# EAGLE design Lab Controller Board v03 (EAGLE 7.5.0)
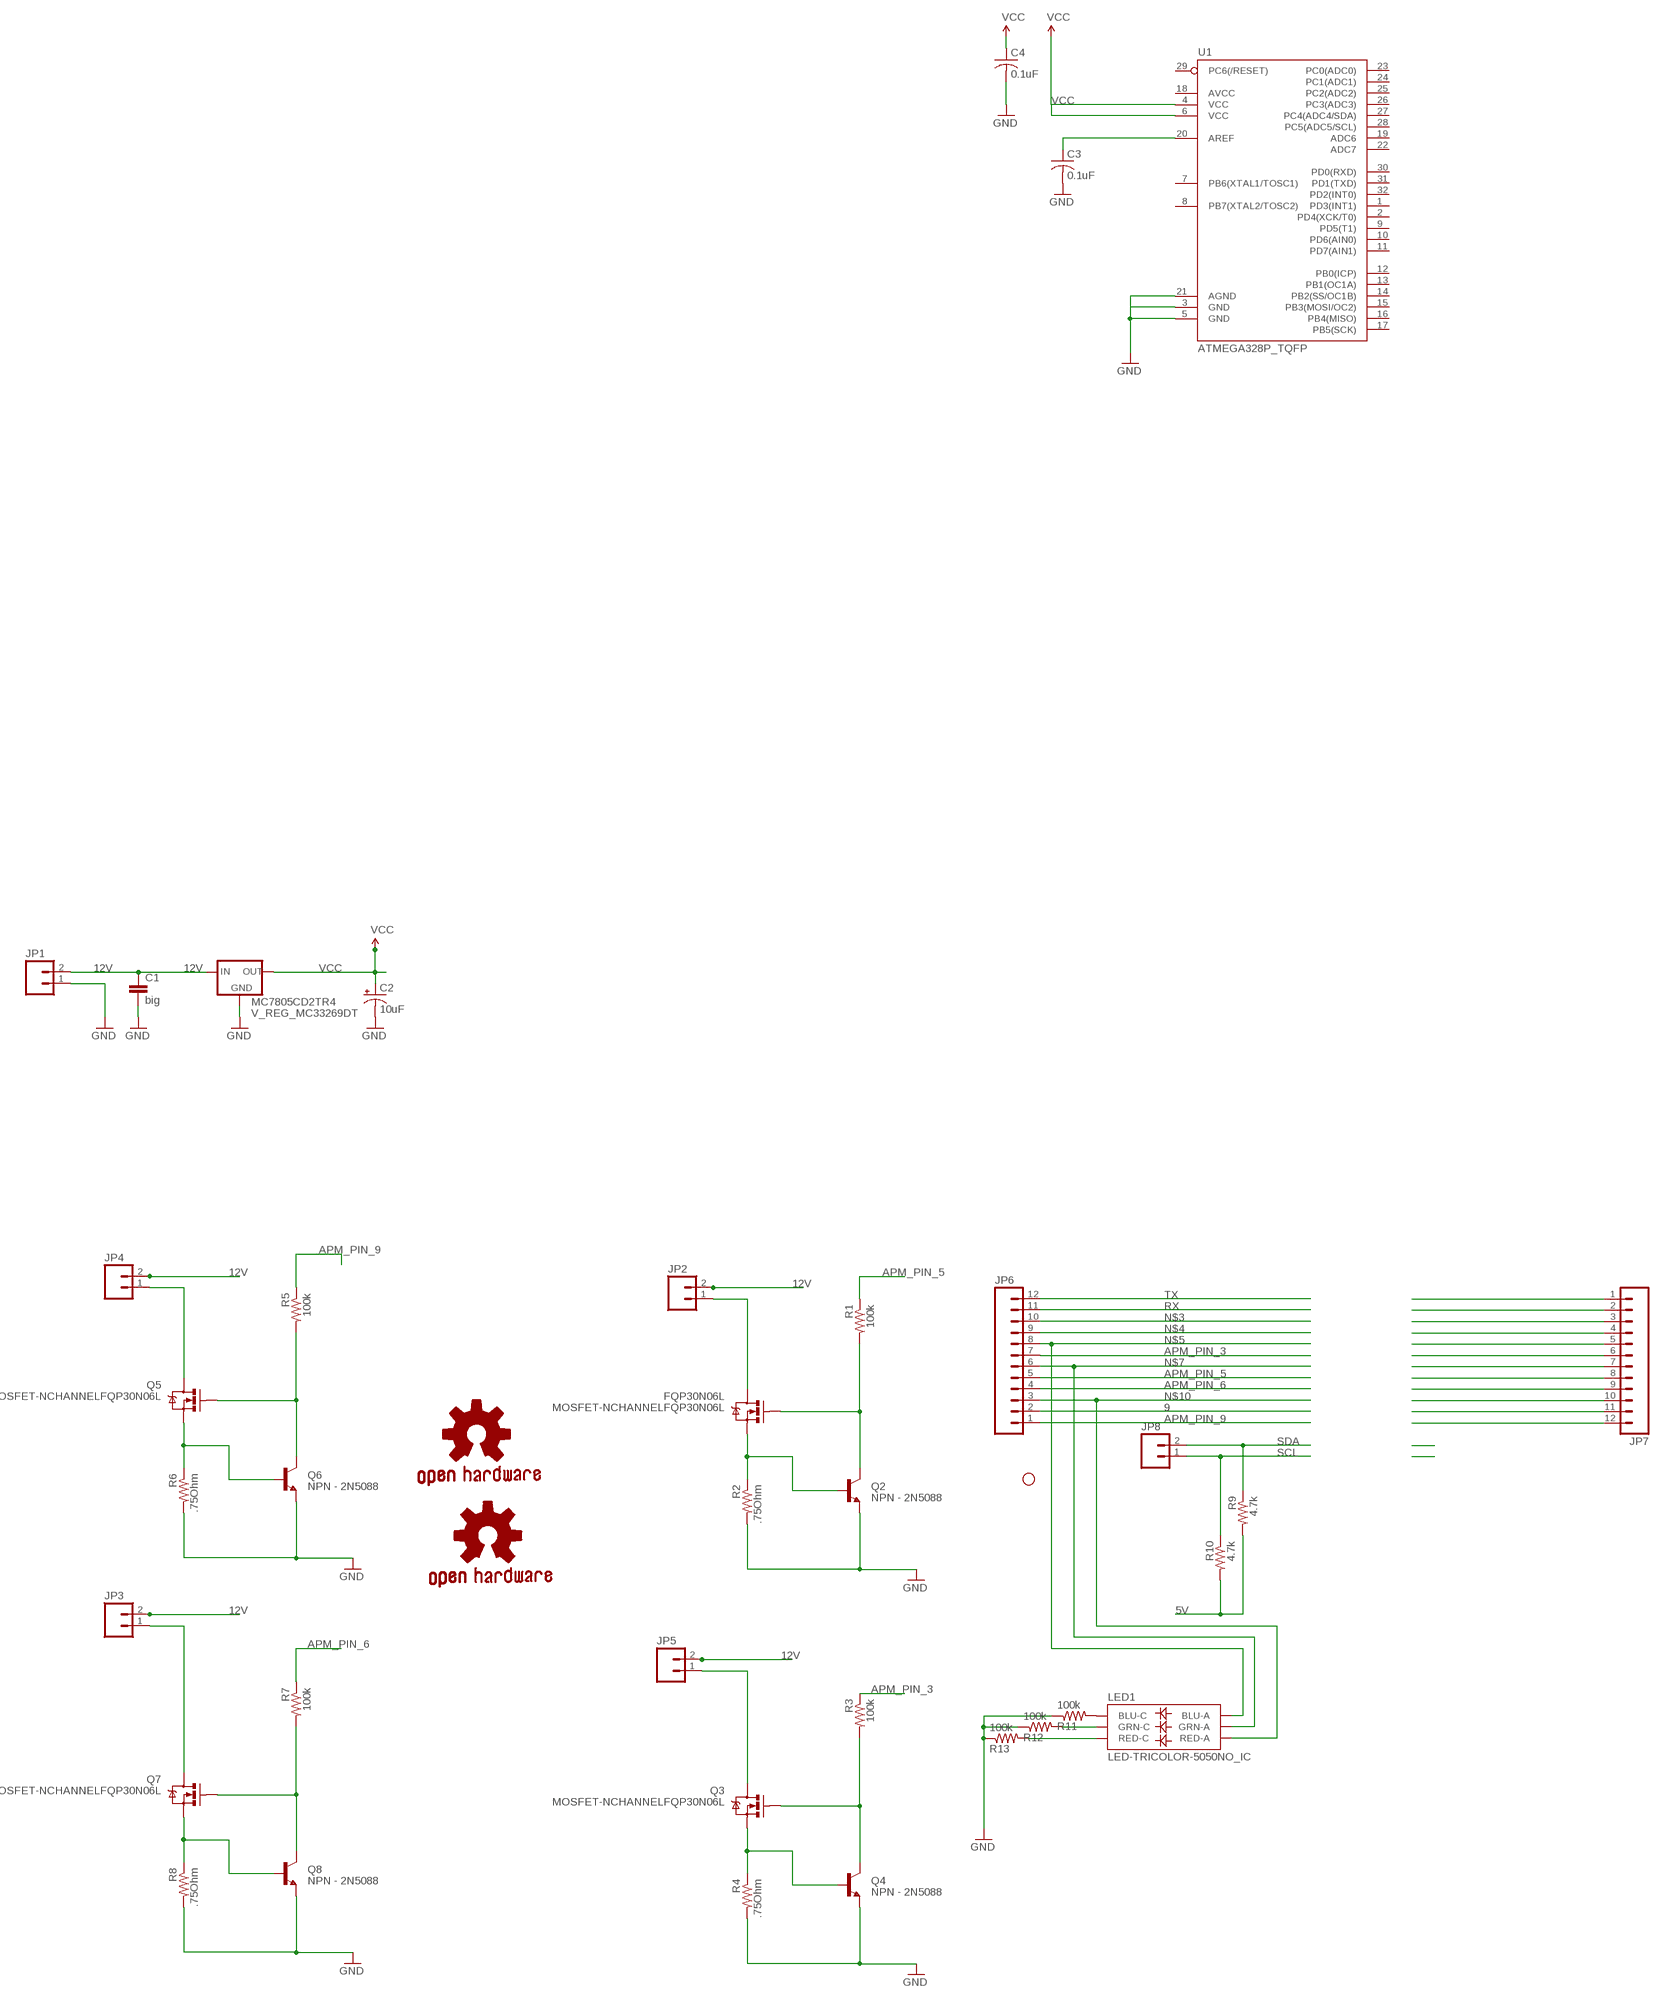
[diagram p0: schematic, sheet 1]

## Parts
C1  big  CAPPTH1  [CAP-PTH-5MM]
C2  10uF  CAP_POL3528  [EIA3528]
C3  0.1uF  C-USC0402  [C0402]
C4  0.1uF  C-USC0402  [C0402]
FQP30N06L  MOSFET-NCHANNELFQP30N06L  [TO220V]
GOLD_ORB_SM1  OSHWLOGO_GOLD_ORB_MED  [OSHW1]
GOLD_ORB_SM2  OSHWLOGO_GOLD_ORB_SM  [OSHW2]
JP1  M025MM  [SCREWTERMINAL-5MM-2]
JP2  M025MM  [SCREWTERMINAL-5MM-2]
JP3  M025MM  [SCREWTERMINAL-5MM-2]
JP4  M025MM  [SCREWTERMINAL-5MM-2]
JP5  M025MM  [SCREWTERMINAL-5MM-2]
JP6  M12PTH  [1X12]
JP7  M12PTH  [1X12]
JP8  M02LOCK  [1X02_LOCK]
LED1  LED-TRICOLOR-5050NO_IC  [LED-TRICOLOR-5050]
MC7805CD2TR4  V_REG_MC33269DT  [DPAK]
Q2  NPN - 2N5088  TRANSISTOR_NPNTO92  [TO-92]
Q3  MOSFET-NCHANNELFQP30N06L  [TO220V]
Q4  NPN - 2N5088  TRANSISTOR_NPNTO92  [TO-92]
Q5  MOSFET-NCHANNELFQP30N06L  [TO220V]
Q6  NPN - 2N5088  TRANSISTOR_NPNTO92  [TO-92]
Q7  MOSFET-NCHANNELFQP30N06L  [TO220V]
Q8  NPN - 2N5088  TRANSISTOR_NPNTO92  [TO-92]
R1  100k  R-US_R0805W  [R0805W]
R2  .75Ohm  R-US_0411/3V  [0411V]
R3  100k  R-US_R0805W  [R0805W]
R4  .75Ohm  R-US_0411/3V  [0411V]
R5  100k  R-US_R0805W  [R0805W]
R6  .75Ohm  R-US_0411/3V  [0411V]
R7  100k  R-US_R0805W  [R0805W]
R8  .75Ohm  R-US_0411/3V  [0411V]
R9  4.7k  R-US_M0805  [M0805]
R10  4.7k  R-US_M0805  [M0805]
R11  100k  R-US_R0805W  [R0805W]
R12  100k  R-US_R0805W  [R0805W]
R13  100k  R-US_R0805W  [R0805W]
STANDOFF1  STAND-OFF  [STAND-OFF]
U1  ATMEGA328P_TQFP  [TQFP32-08]

## Nets
5V: R9.2 R10.2
9: JP6.2
12V: C1.1 JP1.2 JP2.2 JP3.2 JP4.2 JP5.2 MC7805CD2TR4.3(IN)
APM_PIN_3: JP6.7 R3.1
APM_PIN_5: JP6.5 R1.1
APM_PIN_6: JP6.4 R7.1
APM_PIN_9: JP6.1 R5.1
FET_SOURCE: FQP30N06L.3(S) Q2.2(B) R2.1
FET_SOURCE1: Q3.3(S) Q4.2(B) R4.1
FET_SOURCE2: Q5.3(S) Q6.2(B) R6.1
FET_SOURCE3: Q7.3(S) Q8.2(B) R8.1
GND: C1.2 C2.C(-) C3.2 C4.2 JP1.1 MC7805CD2TR4.1(GND) Q2.1(E) Q4.1(E) Q6.1(E) Q8.1(E) R2.2 R4.2 R6.2 R8.2 R11.1 R12.1 R13.1 U1.3(GND) U1.5(GND) U1.21(AGND)
LED_DRAIN: FQP30N06L.2(D) JP2.1
LED_DRAIN1: JP5.1 Q3.2(D)
LED_DRAIN2: JP4.1 Q5.2(D)
LED_DRAIN3: JP3.1 Q7.2(D)
N$1: C3.1 U1.20(AREF)
N$3: JP6.10
N$4: JP6.9
N$5: JP6.8 LED1.3(BLU-A)
N$6: LED1.4(BLU-C) R11.2
N$7: JP6.6 LED1.1(GRN-A)
N$8: LED1.6(GRN-C) R12.2
N$9: LED1.5(RED-C) R13.2
N$10: JP6.3 LED1.2(RED-A)
N$15: JP7.1
N$16: JP7.2
N$17: JP7.3
N$18: JP7.4
N$19: JP7.5
N$20: JP7.6
N$21: JP7.7
N$22: JP7.8
N$23: JP7.9
N$24: JP7.10
N$25: JP7.11
N$26: JP7.12
PWM_B: FQP30N06L.1(G) Q2.3(C) R1.2
PWM_B1: Q3.1(G) Q4.3(C) R3.2
PWM_B2: Q5.1(G) Q6.3(C) R5.2
PWM_B3: Q7.1(G) Q8.3(C) R7.2
RX: JP6.11
SCL: JP8.1 R10.1
SDA: JP8.2 R9.1
TX: JP6.12
VCC: C2.A(+) C4.1 MC7805CD2TR4.4(OUT) U1.4(VCC) U1.6(VCC)
Unconnected: U1.1(PD3(INT1)) U1.2(PD4(XCK/T0)) U1.7(PB6(XTAL1/TOSC1)) U1.8(PB7(XTAL2/TOSC2)) U1.9(PD5(T1)) U1.10(PD6(AIN0)) U1.11(PD7(AIN1)) U1.12(PB0(ICP)) U1.13(PB1(OC1A)) U1.14(PB2(SS/OC1B)) U1.15(PB3(MOSI/OC2)) U1.16(PB4(MISO)) U1.17(PB5(SCK)) U1.18(AVCC) U1.19(ADC6) U1.22(ADC7) U1.23(PC0(ADC0)) U1.24(PC1(ADC1)) U1.25(PC2(ADC2)) U1.26(PC3(ADC3)) U1.27(PC4(ADC4/SDA)) U1.28(PC5(ADC5/SCL)) U1.29(PC6(/RESET)) U1.30(PD0(RXD)) U1.31(PD1(TXD)) U1.32(PD2(INT0))

## Library data of the parts
C1 = SparkFun-Passives:CAP: Capacitor Standard 0603 ceramic capacitor, and 0.1" leaded capacitor.
C2 = SparkFun-Capacitors:CAP_POL: Capacitor Polarized These are standard SMD and PTH capacitors. Normally 10uF, 47uF, and 100uF in electrolytic and tantalum varieties. Always verify the external diameter of the through hole cap, it varies with capacity, voltage, and manufacturer. The EIA devices should be standard.
C3 C4 = resistor:C-US: CAPACITOR, American symbol
FQP30N06L Q3 Q5 Q7 = SparkFun-DiscreteSemi:MOSFET-NCHANNEL: Common NMOSFET Parts MFG P/N Store ID Prod ID FDD8780 TRANS-09984 SI7820DN TRANS-11055 FDS6630A IC-08089 2N7002PW TRANS-11151 FQP30N06L COM-10213 TRANS-10060 BSS123LT1G TRANS-08345 BSS138 TRANS-00830 BS170 2N7000; PROD_ID: TRANS-10060
GOLD_ORB_SM1 GOLD_ORB_SM2 = bfl:OSHWLOGO: These are Open-Source Hardware logos.
JP1-JP5 = SparkFun-Connectors:M02: Standard 2-pin 0.1" header. Use with - straight break away headers ( PRT-00116) - right angle break away headers (PRT-00553) - swiss pins (PRT-00743) - machine pins (PRT-00117) - female headers (PRT-00115) Molex polarized connector foot print use with: PRT-08233 with associated crimp pins and housings. 2.54_SCREWTERM for use with PRT-10571. 3.5mm Screw Terminal footprints for PRT-08084 5mm Screw Terminal footprints for use with PRT-08432; STOREFRONT_ID: PRT-08432
JP6 JP7 = SparkFun-Connectors:M12: Header 12 Standard 12-pin 0.1" header. Use with straight break away headers (SKU : PRT-00116), right angle break away headers (PRT-00553), swiss pins (PRT-00743), machine pins (PRT-00117), and female headers (PRT-00115).
JP8 = SparkFun-Connectors:M02: Standard 2-pin 0.1" header. Use with - straight break away headers ( PRT-00116) - right angle break away headers (PRT-00553) - swiss pins (PRT-00743) - machine pins (PRT-00117) - female headers (PRT-00115) Molex polarized connector foot print use with: PRT-08233 with associated crimp pins and housings. 2.54_SCREWTERM for use with PRT-10571. 3.5mm Screw Terminal footprints for PRT-08084 5mm Screw Terminal footprints for use with PRT-08432
LED1 = SparkFun-LED:LED-TRICOLOR-5050
MC7805CD2TR4 = SparkFun-PowerIC:V_REG_MC33269
Q2 Q4 Q6 Q8 = SparkFun-DiscreteSemi:TRANSISTOR_NPN: Generic NPN BJT MMBT2222A - TRANS-08049 (SOT-23, 1A 40V) MPSA42 - TRANS-09116 (SOT-23, 500mA 300V) MMBT5088LT1G - TRANS-11160 (SOT-23, 50 mA 30V) BC547 - COM-08928 <http://www.sparkfun.com/products/8928> (TO-92 45V 100mA) (1.Collector 2.Base 3.Emitter) 2N3904 - COM-00521 <http://www.sparkfun.com/products/521> (TO-92 40V 200mA) (1.Emitter 2.Base 3.Collector) P2N2222A - COM-12852 <http://www.sparkfun.com/products/12852> (TO-92 40V 600mA) (1.Collector 2.Base 3.Emitter)
R1-R13 = resistor:R-US_: RESISTOR, American symbol
STANDOFF1 = SparkFun-Electromechanical:STAND-OFF: #4 Stand Off This is the mechanical footprint for a #4 phillips button head screw. Use the keepout ring to avoid running the screw head into surrounding components. SKU : PRT-00447
U1 = SparkFun-DigitalIC:ATMEGA328P_TQFP; PROD_ID: IC-09069

## Board
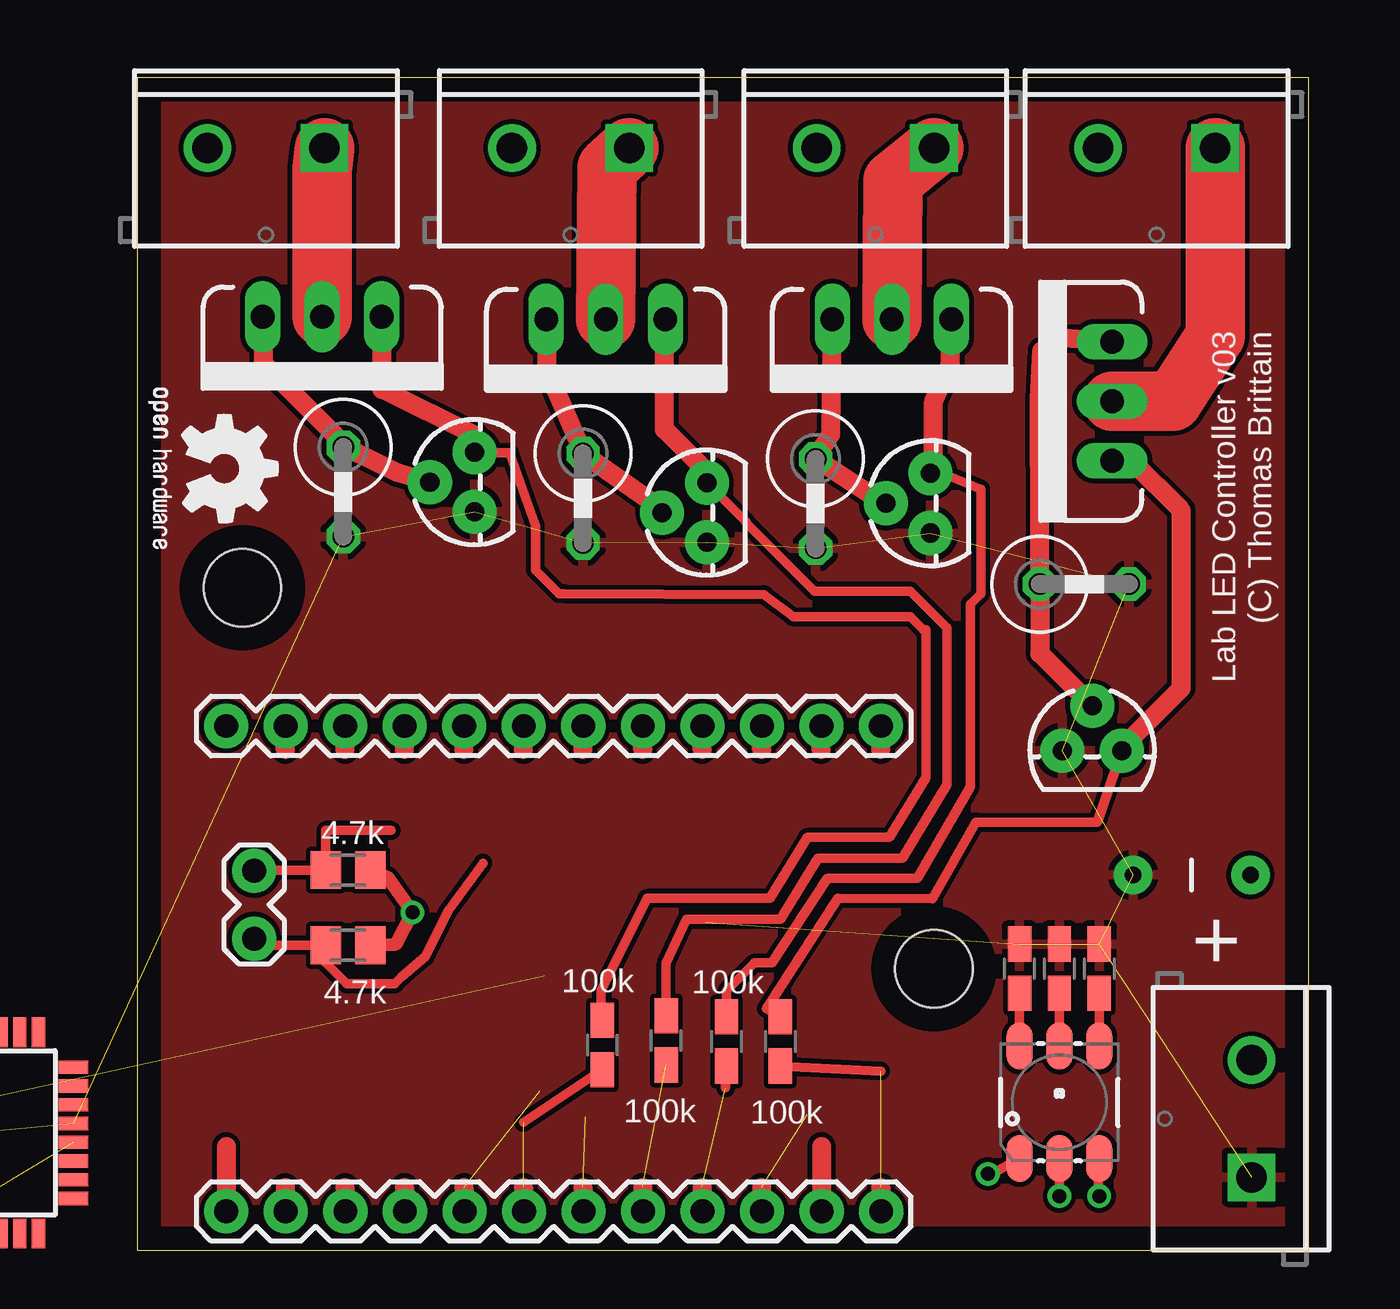
[diagram p1: board, top side]
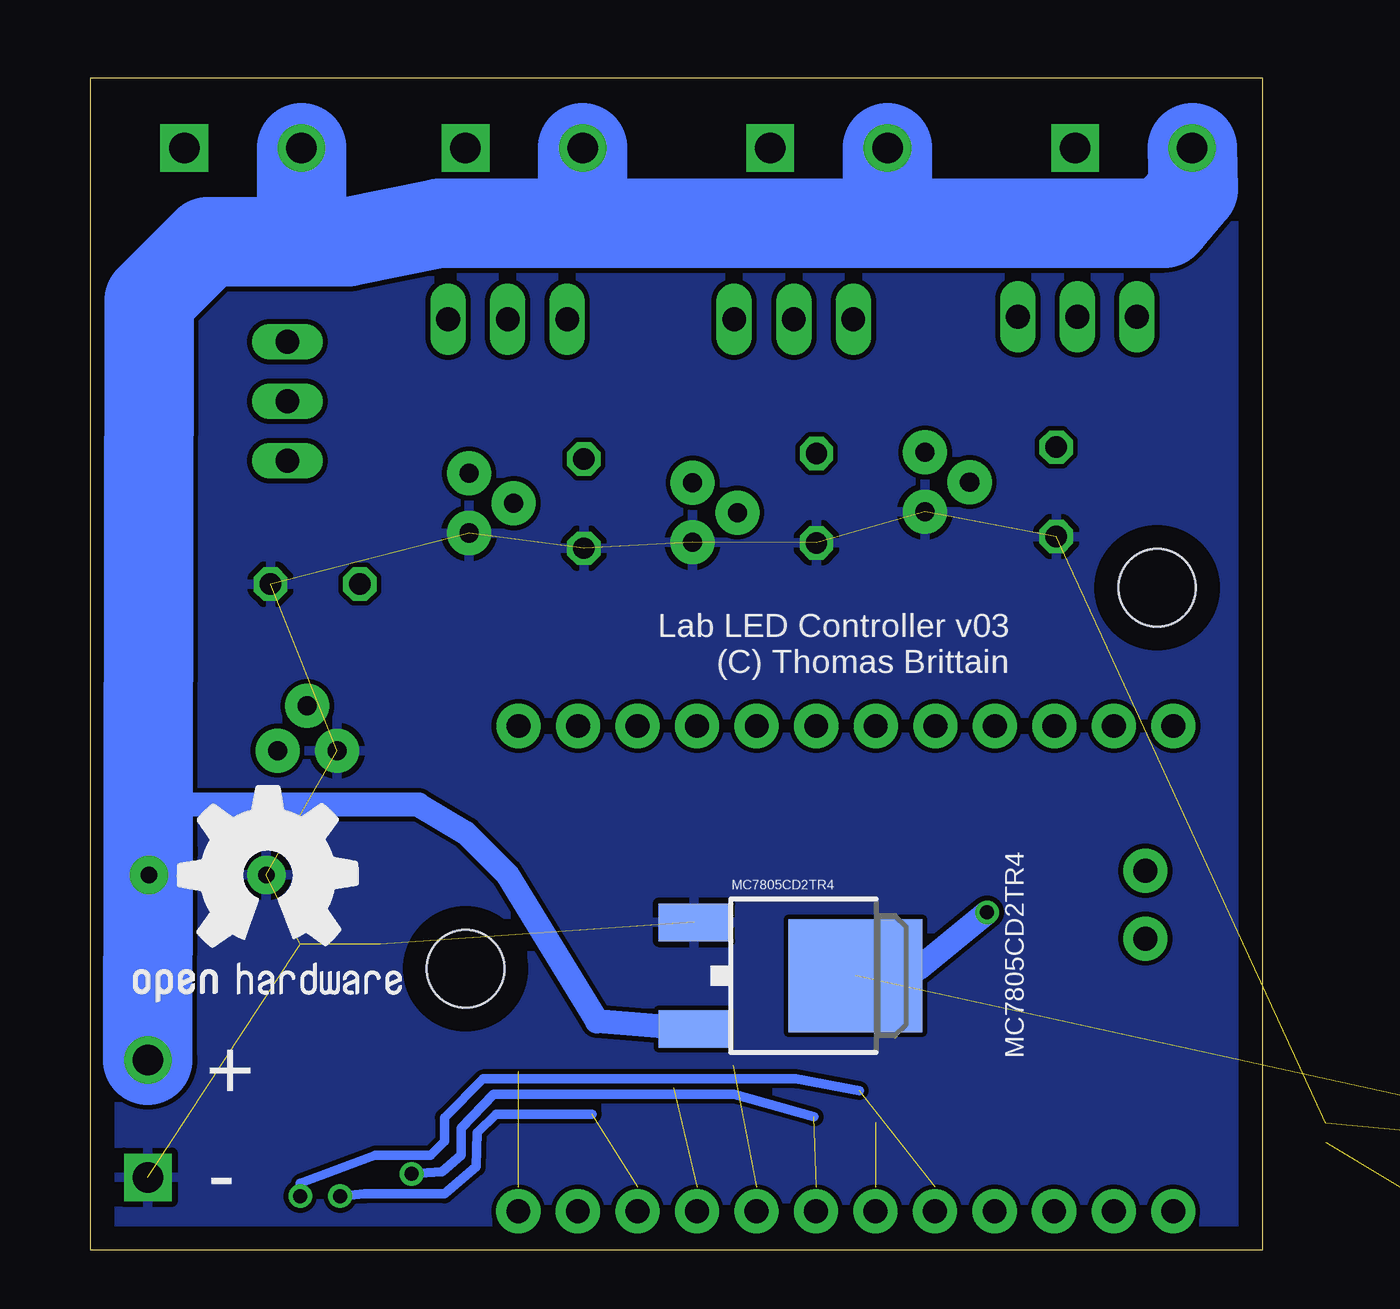
[diagram p2: board, bottom side, seen from below]

Size 50 x 50 mm. Coordinates in mm from the lower left corner, seen from the top.
Outline: 0,0 50,0 50,50 0,50 0,0
Copper layers (1*16): Top 0.035mm / dielectric 1.5mm / Bottom 0.035mm
Design rules "default *": minimum track width 10mil, minimum drill 24mil, track to track 8mil, track to pad 8mil, pad to pad 8mil, via to via 8mil, smd to smd 8mil, copper to edge 40mil, drill to drill 8mil, minimum pad ring 10mil, minimum via ring 8mil, stop-mask expansion 4mil, vias tented up to drill 1.0064mm, thermal gap 10mil

### Footprints (pad centres in the part's own frame; a part is rotated, then mirrored left to right if it is on the bottom)
CAP-PTH-5MM = drill 0.7 pad 1.651: 1 -2.5,0; 2 2.5,0
EIA3528 = smd 1.2 x 2.5: A 1.65,0; C -1.65,0
C0402 = smd 0.7 x 0.9: 1 -0.65,0; 2 0.65,0
TO220V = drill 1.016 long: 1 -2.54,0; 2 0,0; 3 2.54,0
SCREWTERMINAL-5MM-2 = drill 1.3 pad 2.032 square: 1 0,0 | drill 1.3 pad 2.032: 2 5,0
1X12 = drill 1.016 pad 1.88: 1 0,0; 2 2.54,0; 3 5.08,0; 4 7.62,0; 5 10.16,0; 6 12.7,0; 7 15.24,0; 8 17.78,0; 9 20.32,0; 10 22.86,0; 11 25.4,0; 12 27.94,0
1X02_LOCK = drill 1.016 pad 1.88: 1 -0.178,0; 2 2.718,0
LED-TRICOLOR-5050 = smd 2 x 1.1: 1 -2.4,1.7; 2 -2.4,0; 3 -2.4,-1.7; 4 2.4,-1.7; 5 2.4,0; 6 2.4,1.7
DPAK = smd 1.6 x 3: 1 -2.28,-5.31; 3 2.28,-5.31 | smd 4.826 x 5.715: 4 0,1.588
TO-92 = drill 0.813 pad 1.88: 1 -1.27,0; 2 0,1.905; 3 1.27,0
R0805W = smd 1.5 x 1: 1 -1.052,0; 2 1.052,0
0411V = drill 0.914 octagon: 1 -2.54,0; 2 1.27,0
M0805 = smd 1.3 x 1.6: 1 -0.95,0; 2 0.95,0
STAND-OFF = hole 3.302: 0,0
TQFP32-08 = smd 1.27 x 0.559: 1 -4.293,2.8; 2 -4.293,2; 3 -4.293,1.2; 4 -4.293,0.4; 5 -4.293,-0.4; 6 -4.293,-1.2; 7 -4.293,-2; 8 -4.293,-2.8; 17 4.293,-2.8; 18 4.293,-2; 19 4.293,-1.2; 20 4.293,-0.4; 21 4.293,0.4; 22 4.293,1.2; 23 4.293,2; 24 4.293,2.8 | smd 0.559 x 1.27: 9 -2.8,-4.293; 10 -2,-4.293; 11 -1.2,-4.293; 12 -0.4,-4.293; 13 0.4,-4.293; 14 1.2,-4.293; 15 2,-4.293; 16 2.8,-4.293; 25 2.8,4.293; 26 2,4.293; 27 1.2,4.293; 28 0.4,4.293; 29 -0.4,4.293; 30 -1.2,4.293; 31 -2,4.293; 32 -2.8,4.293

### Placement (x,y rotation side)
C1  45,16 180 top
C2  -16,0 0 top  (outside the outline)
C3  -18,-5 0 top  (outside the outline)
C4  -18,-10 0 top  (outside the outline)
FQP30N06L  20,39.7 180 top
GOLD_ORB_SM1  48.8,8.85 0 bottom
GOLD_ORB_SM2  -0.55,37.15 270 top
JP1  47.55,3.1 90 top
JP2  21,47 180 top
JP3  34,47 180 top
JP4  46,47 180 top
JP5  8,47 180 top
JP6  31.75,1.65 180 top
JP7  3.8,22.35 0 top
JP8  5,16 270 top
LED1  39.35,6.3 90 top
MC7805CD2TR4  18.95,11.7 270 bottom
Q2  24.31,31.45 90 top
Q3  7.9,39.8 180 top
Q4  14.4,32.75 90 top
Q5  41.6,36.2 90 top
Q6  40.75,21.3 0 top
Q7  32.2,39.7 180 top
Q8  33.85,31.85 90 top
R1  22.57,8.94 90 top
R2  19.03,31.43 270 top
R3  19.85,8.75 90 top
R4  8.8,31.7 270 top
R5  27.45,8.9 90 top
R6  41.05,28.4 0 top
R7  25.15,8.9 90 top
R8  28.95,31.2 270 top
R9  9,13 0 top
R10  9,16.2 0 top
R11  41.05,12 270 top
R12  37.65,12 270 top
R13  39.35,12 270 top
STANDOFF1  4.5,28.25 0 top
STANDOFF2  STAND-OFF  [STAND-OFF]  34,12 0 top
U1  -7,5 0 top

### Tracks (layer width: path | path; a pad name or v marks a point on that pad's centre or on a via)
5V  (via drill 0.6)
  Top 0.559: R10.2 10.7,15.9 v11.75,14.4 11.05,13.05 R9.2
  Bottom 1.016: 14.7,12 v11.75,14.4
9
  Top 0.813: 29.21,4.42 JP6.2
12V
  Bottom 0.406: JP1.2 47.55,8.45
  Bottom 0.813: 47.53,19 | C1.1 47.5,16.96 47.54,17
  Bottom 1.016: MC7805CD2TR4.3 28.4,9.75 32.22,16.02 34,17.8 36,19 47.53,19
  Bottom 3.81: JP1.2 47.54,17 47.53,19 47.5,39.95 47.5,40.5 45,43 41,43 | 41,43 39,43 35.1,43.8 29,43.8 | JP4.2 41,43 | 29,43.8 16,43.8 | 16,43.8 4.2,43.8 4,44 2.95,45.25 JP5.2 | JP2.2 16,43.8 | JP3.2 29,43.8
APM_PIN_3  (1 unrouted)
  Top 0.406: 16.49,5.45 R3.1
  Top 0.813: 16.49,2.67 JP6.7
APM_PIN_5  (1 unrouted)
  Top 0.406: 22.57,8 R1.1
  Top 0.813: 21.57,2.67 JP6.5
APM_PIN_6  (1 unrouted)
  Top 0.406: 25.11,6.92 R7.1
  Top 0.813: 24.11,2.67 JP6.4
APM_PIN_9  (1 unrouted)
  Top 0.406: 31.73,7.63 R5.1
  Top 0.813: 31.73,2.67 JP6.1
FET_SOURCE
  Top 0.406: Q2.2 22.41,31.59 | 17.5,39.66 FQP30N06L.3
  Top 0.813: FQP30N06L.3 17.46,39.66 | 22.41,31.59 R2.1 19.03,34.02 17.5,37.55 17.5,39.66
FET_SOURCE1
  Top 0.406: 5.3,39.74 Q3.3
  Top 0.813: 5.55,39.61 Q3.3 5.4,39.76 5.4,37.8 9.05,34.15 R4.1 9.06,34.15 11.1,33.15 Q4.2
FET_SOURCE2
  Top 0.813: Q5.3 39.54,38.89 38.6,38.35 38.5,36.3 38.51,30.49 R6.1 38.51,25.45 Q6.2
FET_SOURCE3
  Top 0.406: Q8.2 31.84,31.85
  Top 0.813: 31.84,31.85 R8.1 29.6,34.79 Q7.3
GND  (19 unrouted)
  pour Bottom: -1,51 51,51 51,-2 -1,-2
  pour Top: -1,51 51,51 51,-2 -1,-2
LED_DRAIN
  Top 2.54: FQP30N06L.2 20.05,46.15 JP2.1
LED_DRAIN1
  Top 2.54: Q3.2 7.9,46.1 JP5.1
LED_DRAIN2
  Top 2.54: Q5.2 44.2,36.2 46,39 JP4.1
LED_DRAIN3
  Top 2.54: Q7.2 32.25,45.6 JP3.1
N$1  (1 unrouted)
N$3
  Top 0.813: 8.87,2.67 JP6.10
N$4
  Top 0.813: 11.41,2.67 JP6.9
N$5  (via drill 0.6)  (1 unrouted)
  Top 0.406: v41.05,2.3 41,3.25 LED1.3
  Top 0.813: 13.95,2.67 JP6.8
  Bottom 0.406: 17.2,6.8 19.9,7.3 33.25,7.3 34.9,5.65 34.9,4.65 35.5,4.05 37.85,4.05 41.05,2.85 v41.05,2.3
N$6
  Top 0.406: LED1.4 R11.2
N$7  (via drill 0.6)  (1 unrouted)
  Top 0.406: v36.3,3.25 36.75,3.4 LED1.1
  Top 0.813: 19.03,2.67 JP6.6
  Bottom 0.406: 19.13,5.68 22.55,6.65 32.8,6.65 34.2,5.2 34.2,4.05 35,3.35 v36.3,3.25
N$8
  Top 0.406: LED1.6 R12.2
N$9
  Top 0.406: LED1.5 R13.2
N$10  (via drill 0.6)  (1 unrouted)
  Top 0.406: v39.35,2.3 LED1.2
  Top 0.813: 26.65,2.67 JP6.3
  Bottom 0.406: 28.6,5.8 32.7,5.8 33.5,5 33.55,3.55 34.9,2.4 38.3,2.4 v39.35,2.3
N$15
  Top 0.813: JP7.1
N$16
  Top 0.813: 6.33,21.34 JP7.2
N$17
  Top 0.813: 8.87,21.34 JP7.3
N$18
  Top 0.813: 11.41,21.34 JP7.4
N$19
  Top 0.813: 13.95,21.34 JP7.5
N$20
  Top 0.813: 16.49,21.34 JP7.6
N$21
  Top 0.813: 19.03,21.34 JP7.7
N$22
  Top 0.813: 21.57,21.34 JP7.8
N$23
  Top 0.813: 24.11,21.34 JP7.9
N$24
  Top 0.813: 26.65,21.34 JP7.10
N$25
  Top 0.813: 29.19,21.34 JP7.11
N$26
  Top 0.813: 31.73,21.34 JP7.12
PWM_B
  Top 0.406: R1.2 22.57,12.22 23.45,14.1 27.45,14.1 29.05,16.7 32.65,16.7 34.55,19.85 34.55,26.55 33,28.1 28.9,28.1 26,31 26,31.03 Q2.3
  Top 0.813: Q2.3 24.31,33.19 22.5,35 22.5,39.66 FQP30N06L.1
PWM_B1
  Top 0.406: R3.2 19.8,9.74 19.8,11.05 21.75,15 27,15 28.6,17.6 32.1,17.6 33.65,20.15 33.65,26.45 33.55,26.45 33,27 28,27 26.75,27.95 18.2,28 18,28 17,29 17,30.9 15.9,34 14.42,34 Q4.3
  Top 0.813: Q3.1 10.45,36.7 14.4,34.75 Q4.3
PWM_B2
  Top 0.406: R5.2 26.85,10.3 29.9,15 33.94,14.99 35.8,18.25 40.97,18.25 Q6.3
  Top 0.813: Q6.3 42.02,21.42 44.55,23.95 44.55,31.55 42.45,33.65 40.71,33.65 Q5.1
PWM_B3
  Top 0.406: R7.2 25.15,11.05 26.35,12.25 27.1,12.25 29.45,15.85 33.3,15.85 35.55,19.75 35.55,27.55 36,28 36,32.45 34.05,33.25 | 33.98,33.25 Q8.3
  Top 0.813: 34.05,33.25 33.98,33.25 | 33.98,33.25 33.85,33.25 | Q7.1 34.7,39.66 34.7,37.75 33.98,36.18 33.98,33.25
RX
  Top 0.813: 6.33,2.67 JP6.11
SCL
  Top 0.406: 10.85,17.9 8.05,17.9 R10.1 5.02,16.2 JP8.1
SDA
  Top 0.406: 14.76,16.5 13.3,14.5 12.3,12.5 11.3,11.65 11,11.35 8.95,11.35 8.05,12.25 R9.1 5.28,13 JP8.2
TX
  Top 0.813: 3.81,4.42 JP6.12
VCC  (4 unrouted)

### Text on the board
tNames: Lab LED Controller v03 / (C) Thomas Brittain | 4.7k | 100k | 100k | + | 4.7k | 100k | 100k
bNames: Lab LED Controller v03 / (C) Thomas Brittain | MC7805CD2TR4 | + | -